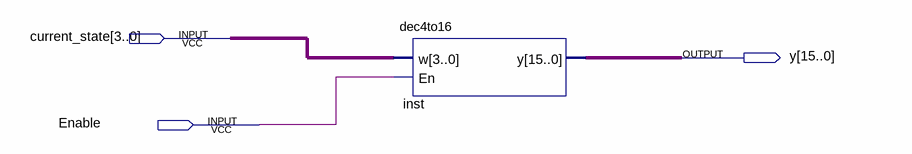
[diagram p0: schematic sheet]
// Quartus schematic dec4to16test.bdf as structural Verilog: 1 symbols, 3 pins
module dec4to16test (
  input  [3:0] current_state,
  input  Enable,
  output [15:0] y
);

  dec4to16 inst (.w(current_state), .En(Enable), .y(y));
endmodule
